# Altium schematic sheet PWR SMPS 5A 36V.SchDoc
size 209 x 297 mm; Author: Мурашкин Д.В.; Address1: Address1; Address2: Address2; Address3: Address3; Address4: Address4; DocumentNumber: SS19946-01; Scale: 1:1; Letter1Column: Э; PartName: Блок питания
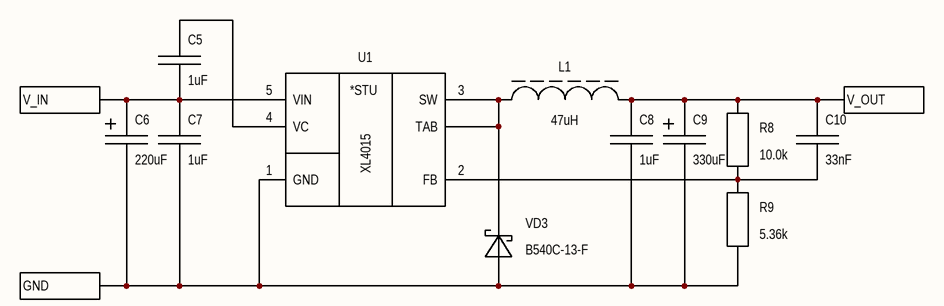
[diagram p0: PWR SMPS 5A 36V.SchDoc]

## Parts
C5  1uF  [CAPC2012L]
C6  220uF  [CAPA10LS G]
C7  1uF  [CAPC2012L]
C8  1uF  [CAPC2012L]
C9  330uF  [CAPA8LS F]
C10  33nF  [CAPC1608L]
L1  47uH  [INDF13.5x12.5SSH]
R8  10.0k  [RESC1608L]
R9  5.36k  [RESC1608L]
U1  XL4015  [TO-263-5]
VD3  B540C-13-F  [DO-214AB]

## Ports
GND, V_IN, V_OUT

## Nets
GND: C6.2 C7.2 C8.2 C9.2 R9.2 U1.1(GND) VD3.1(Anode) ; port GND
V_IN: C5.2 C6.1 C7.1 U1.5(VIN) ; port V_IN
V_OUT: C8.1 C9.1 C10.1 L1.2 R8.1 ; port V_OUT
NetC5_1: C5.1 U1.4(VC)
NetC10_2: C10.2 R8.2 R9.1 U1.2(FB)
NetL1_1: L1.1 U1.3(SW) U1.6(TAB) VD3.2(Cathode)

## Notes on the sheet
- Перв. примен.
- Справ. №
- Подп. и дата
- Инв. № дубл.
- Взам. инв. №
- Разраб.
- Изм.
- Лист
- № докум.
- Подп.
- Дата
- Лит.
- Масса
- Масштаб
- Пров.
- Т.контр.
- Листов
- Инв. № подл.
- Утв.
- Н.контр.
- 2.106-A4
- Копировал
- Формат А4
- (in symbol XL4015) *STU

## Library data of the parts
C5 C7 C8 = CC0805KKX7R9BB105: Capacitor Ceramic 1uF 50V 0805(2012); Manufacturer: Yageo; Group: Ceramic Capacitors; Temperature Coefficient: X7R; Tolerance: ±10%; Voltage: 50; Type: Ceramic; Part name: CC0805KKX7R9BB105; Package: 0805 (2012); Value: 1uF
C6 = UCW1H221MNL1GS: Capacitor Aluminum 220uF 50V G; Manufacturer: Nichicon; Group: Aluminum Capacitors; Type: Aluminium; Voltage: 50; Tolerance: ±20%; Part name: UCW1H221MNL1GS; Package: G d10x10mm (10.3x10.3); Value: 220uF
C9 = UWT1E331MNL1GS: Capacitor Aluminum 330uF 25V F; Manufacturer: Nichicon; Group: Aluminum Capacitors; Type: Aluminium; Voltage: 25; Tolerance: ±20%; Part name: UWT1E331MNL1GS; Package: F d8x10mm (8.3x8.3); Value: 330uF
C10 = CC0603KRX7R9BB333: Capacitor Ceramic 33nF 50V 0603(1608); Manufacturer: Yageo; Group: Ceramic Capacitors; Temperature Coefficient: X7R; Tolerance: ±10%; Voltage: 50; Type: Ceramic; Part name: CC0603KRX7R9BB333; Package: 0603 (1608); Value: 33nF
L1 = SRP1265A-470M: Fixed Inductor 6.5A 47µH; Manufacturer: Bourns; Group: Fixed Inductors; Tolerance: ±20%; Type: Wirewound; Current Rating: 6.5; Part name: SRP1265A-470M; Package: 13.5x12.5x6.4mm; Value: 47uH
R8 = RC0603FR-0710KL: Resistor Ceramic 10k ±1% 0.1W 0603(1608); Manufacturer: Yageo; Group: Resistors; Temperature Coefficient: ±100ppm/°C; Part name: RC0603FR-0710KL; Tolerance: ±1%; Type: Thin Film; Power: 0.1W; Package: 1608; Value: 10.0k
R9 = RC0603FR-075K36L: Resistor Ceramic 5.36k ±1% 0.1W 0603(1608); Manufacturer: Yageo; Group: Resistors; Temperature Coefficient: ±100ppm/°C; Part name: RC0603FR-075K36L; Tolerance: ±1%; Type: Thin Film; Power: 0.1W; Package: 1608; Value: 5.36k
U1 = XL4015: SWR Down 5A ADJ (8-36V); Manufacturer: XLSEMI; Group: PMIC - Voltage Regulators - DC DC Switching Regulators; Package: TO-263-5; Part name: XL4015; Datasheet: http://www.xlsemi.com/datasheet/xl4015%20datasheet.pdf
VD3 = B540C-13-F: Diode Schottky 5A 40V; Manufacturer: Diodes Incorporated; Group: Diodes - Rectifiers - Single; Package: DO-214AB; Part name: B540C-13-F